# EAGLE schematic clock sync (EAGLE 6.5.0)

## Sheet 1 of 2
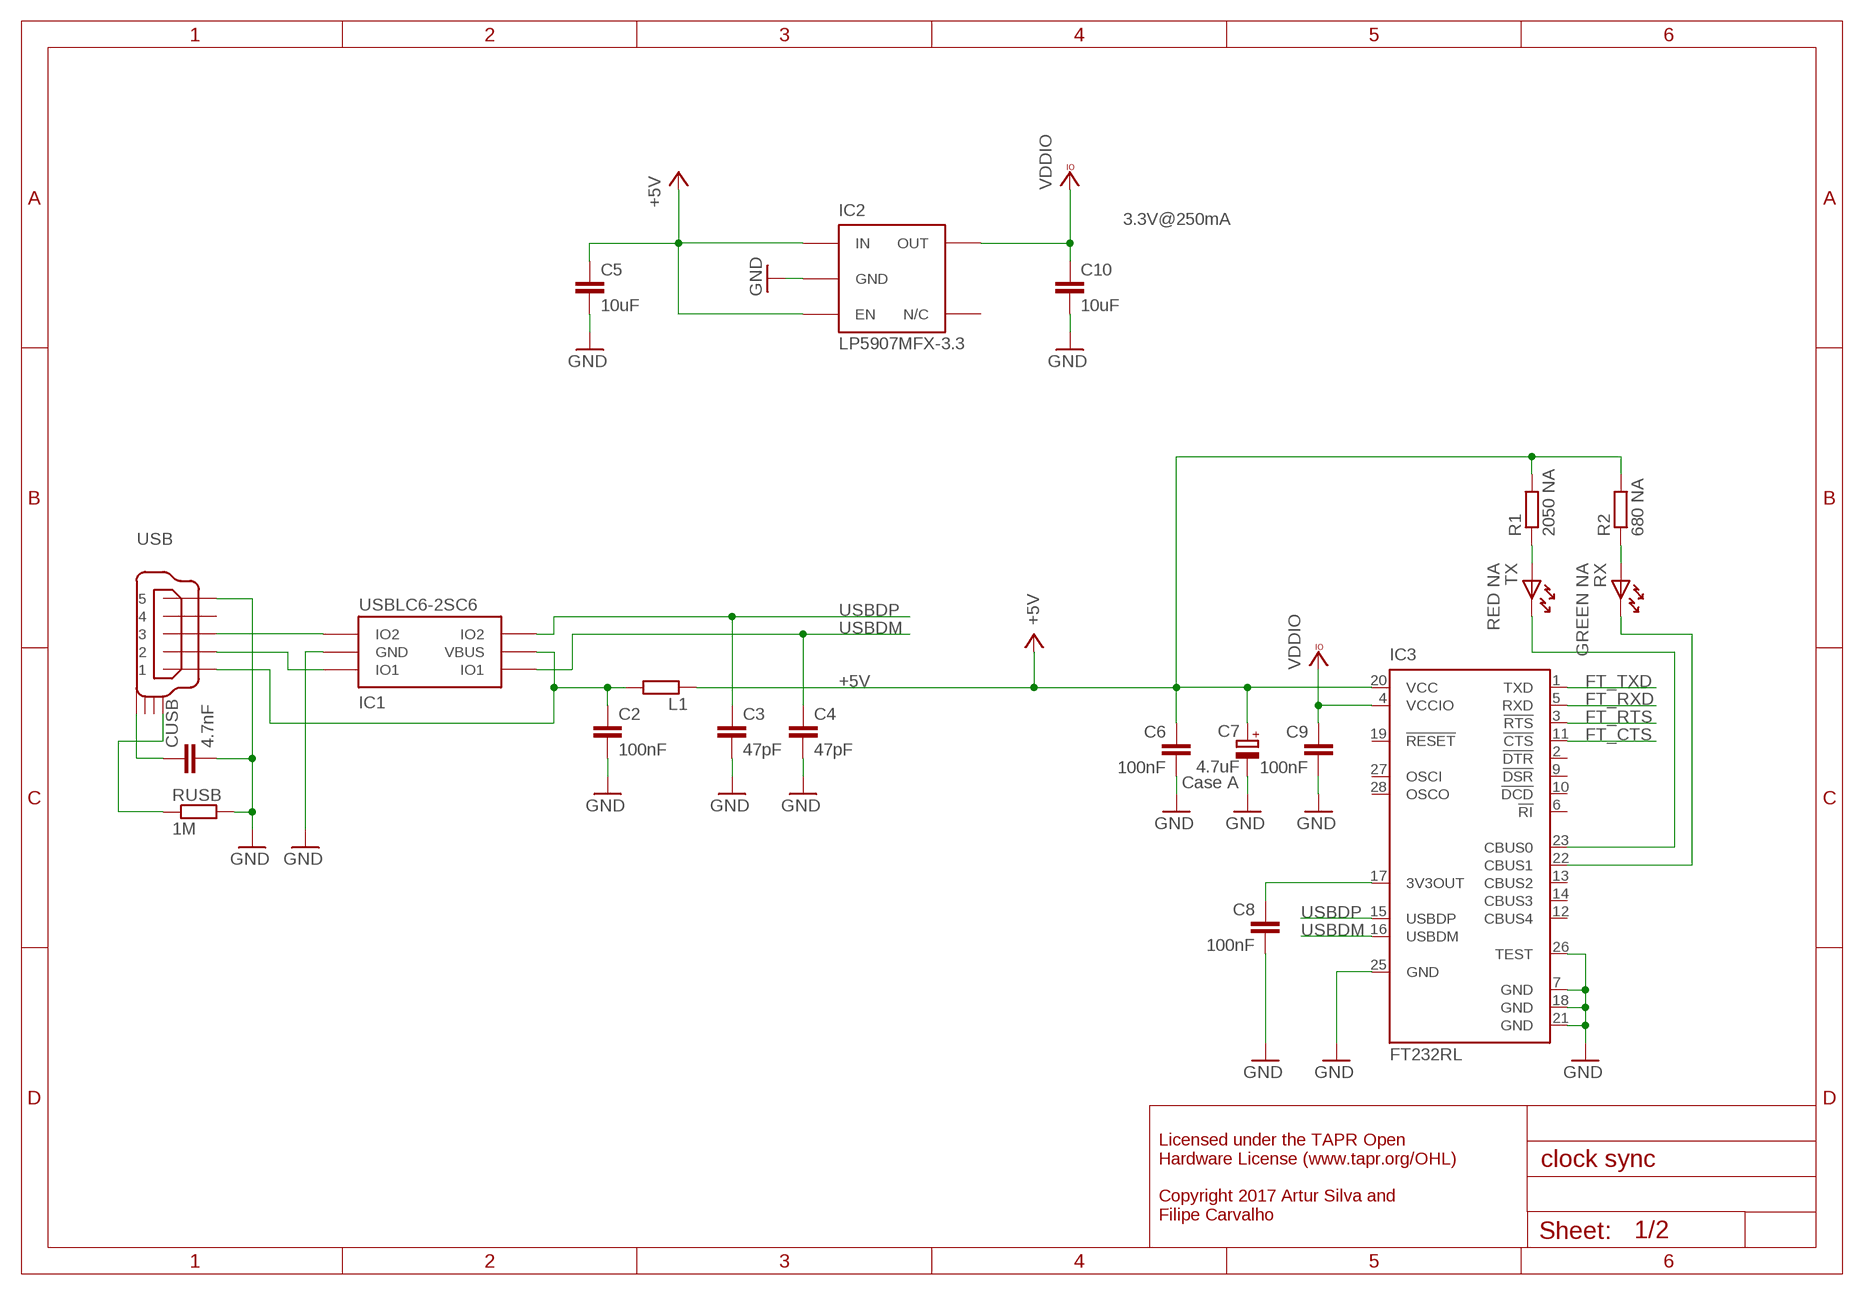
[diagram p0: schematic, sheet 1]

### Parts
C2  100nF  C-EUC0402  [C0402]
C3  47pF  C-EUC0402  [C0402]
C4  47pF  C-EUC0402  [C0402]
C5  10uF  C-EUC0603  [C0603]
C6  100nF  C-EUC0402  [C0402]
C7  4.7uF  CPOL-EUA/3216-18W  [A/3216-18W]
C8  100nF  C-EUC0402  [C0402]
C9  100nF  C-EUC0402  [C0402]
C10  10uF  C-EUC0603  [C0603]
CUSB  4.7nF  C-EUC0402  [C0402]
IC1  USBLC6-2SC6  USBLC6-2  [SOT23-6L]
IC2  LP5907MFX-3.3  TLV700XX  [TSOT23-5]
IC3  FT232RL  [SSOP28]
L1  ???  R-EU_R0805  [R0805]
R1  2050 NA  R-EU_R0402  [R0402]
R2  680 NA  R-EU_R0402  [R0402]
RUSB  1M  R-EU_R0402  [R0402]
RX  GREEN NA  LEDHAND  [LED_HAND]
TX  RED NA  LEDHAND  [LED_HAND]
USB  USB_MINI_B  [240-0002-1]

### Nets
+5V: C5.1 C6.1 C7.+ IC2.1(IN) IC2.3(EN) IC3.20(VCC) L1.1 R1.2 R2.2
FT_CTS: IC3.11(!CTS) ; also sheet 2
FT_RTS: IC3.3(!RTS) ; also sheet 2
FT_RXD: IC3.5(RXD) ; also sheet 2
FT_TXD: IC3.1(TXD) ; also sheet 2
GND: C2.2 C3.2 C4.2 C5.2 C6.2 C7.- C8.2 C9.2 C10.2 CUSB.2 IC1.P$2(GND) IC2.2(GND) IC3.7(GND) IC3.18(GND) IC3.21(GND) IC3.25(GND) IC3.26(TEST) RUSB.2 USB.P$5 ; also sheet 2
N$38: C8.1 IC3.17(3V3OUT)
N$39: C2.1 IC1.P$5(VBUS) L1.2 USB.P$1
N$40: IC1.P$1(IO1) USB.P$2
N$47: R2.1 RX.A
N$48: IC3.23(CBUS0) TX.K
N$49: IC3.22(CBUS1) RX.K
N$50: IC1.P$3(IO2) USB.P$3
N$59: CUSB.1 USB.SHIELD_4
N$61: RUSB.1 USB.SHIELD_1
N$62: R1.1 TX.A
USBDM: C4.1 IC1.P$6(IO1) IC3.16(USBDM)
USBDP: C3.1 IC1.P$4(IO2) IC3.15(USBDP)
VCCIO: C9.1 C10.1 IC2.5(OUT) IC3.4(VCCIO) ; supply symbol labelled VDDIO ; also sheet 2
Unconnected: IC2.4(N/C) IC3.2(!DTR) IC3.6(!RI) IC3.9(!DSR) IC3.10(!DCD) IC3.12(CBUS4) IC3.13(CBUS2) IC3.14(CBUS3) IC3.19(!RESET) IC3.27(OSCI) IC3.28(OSCO) USB.P$4 USB.SHIELD_2 USB.SHIELD_3

### Notes on the sheet
- 3.3V@250mA
- Case A
- Licensed under the TAPR Open
  Hardware License (www.tapr.org/OHL)
  
  Copyright 2017 Artur Silva and 
  Filipe Carvalho

## Sheet 2 of 2
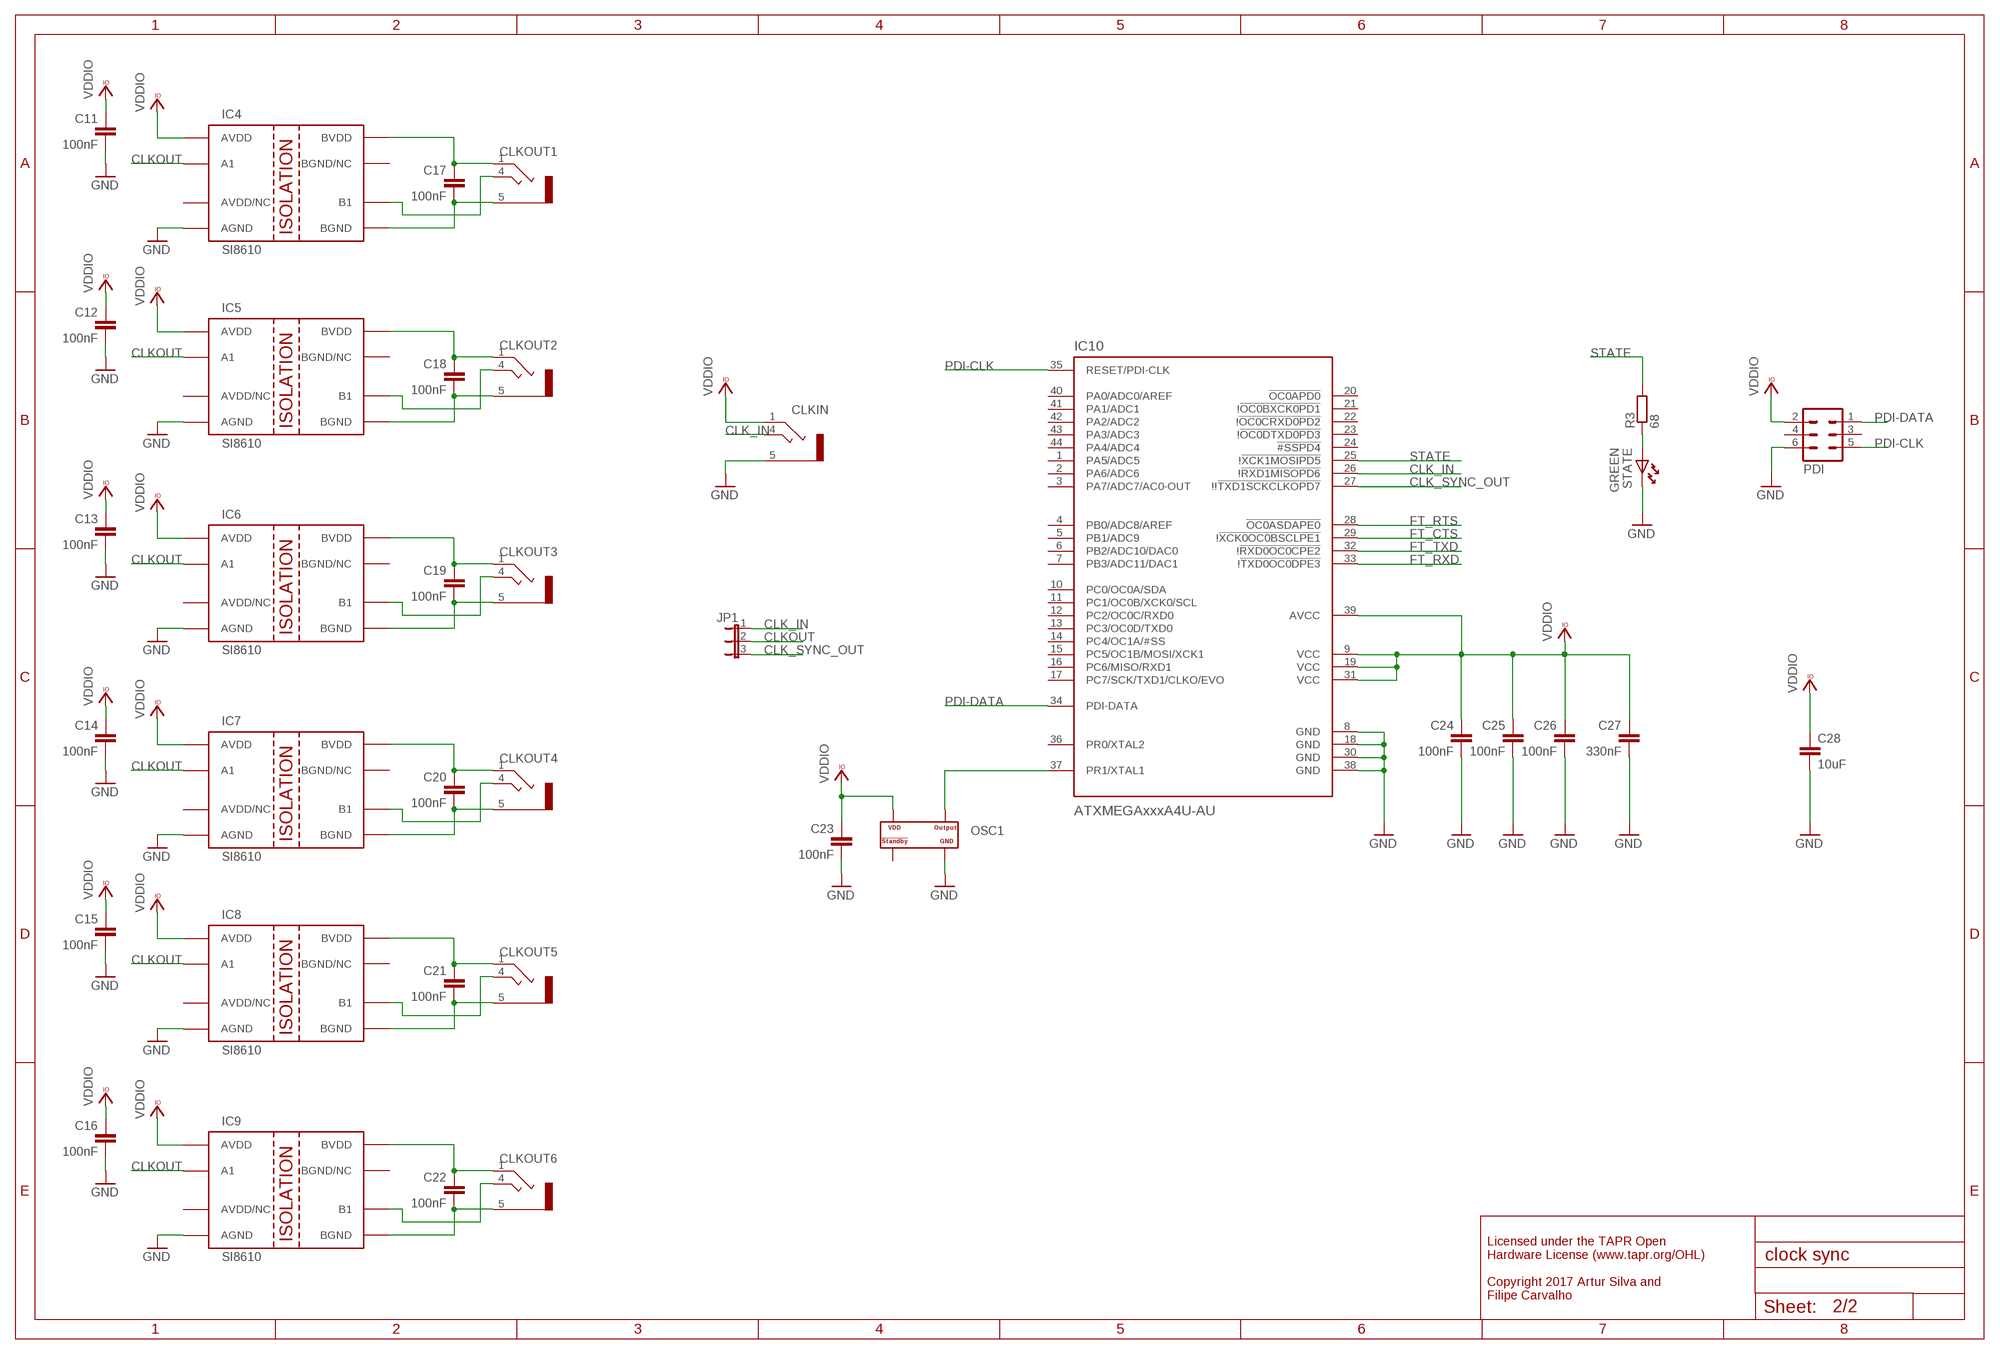
[diagram p1: schematic, sheet 2]

### Parts
C11  100nF  C-EUC0402  [C0402]
C12  100nF  C-EUC0402  [C0402]
C13  100nF  C-EUC0402  [C0402]
C14  100nF  C-EUC0402  [C0402]
C15  100nF  C-EUC0402  [C0402]
C16  100nF  C-EUC0402  [C0402]
C17  100nF  C-EUC0402  [C0402]
C18  100nF  C-EUC0402  [C0402]
C19  100nF  C-EUC0402  [C0402]
C20  100nF  C-EUC0402  [C0402]
C21  100nF  C-EUC0402  [C0402]
C22  100nF  C-EUC0402  [C0402]
C23  100nF  C-EUC0402  [C0402]
C24  100nF  C-EUC0402  [C0402]
C25  100nF  C-EUC0402  [C0402]
C26  100nF  C-EUC0402  [C0402]
C27  330nF  C-EUC0402  [C0402]
C28  10uF  C-EUC0603  [C0603]
CLKIN  STEREO_JACK  [35RASMT2BHNTRX]
CLKOUT1  STEREO_JACK  [35RASMT2BHNTRX]
CLKOUT2  STEREO_JACK  [35RASMT2BHNTRX]
CLKOUT3  STEREO_JACK  [35RASMT2BHNTRX]
CLKOUT4  STEREO_JACK  [35RASMT2BHNTRX]
CLKOUT5  STEREO_JACK  [35RASMT2BHNTRX]
CLKOUT6  STEREO_JACK  [35RASMT2BHNTRX]
IC4  SI8610  [SO-08]
IC5  SI8610  [SO-08]
IC6  SI8610  [SO-08]
IC7  SI8610  [SO-08]
IC8  SI8610  [SO-08]
IC9  SI8610  [SO-08]
IC10  ATXMEGAxxxA4U-AU  AT-XMEGA-XXA4-AU  [QFP80P1200X1200X120-44N]
JP1  JP2E"  [JP2_NO_NUMBERS]
OSC1  OSCILLATOR  [OSCILLATOR_3.2X2.5]
PDI  MA03-2  [MA03-2]
R3  68  R-EU_R0402  [R0402]
STATE  GREEN  LEDHAND  [LED_HAND]

### Nets
CLK_IN: CLKIN.4 IC10.26(!!RXD1MISOPD6) JP1.1
CLK_SYNC_OUT: IC10.27(!!!TXD1SCKCLKOPD7) JP1.3
CLKOUT: IC4.2(A1) IC5.2(A1) IC6.2(A1) IC7.2(A1) IC8.2(A1) IC9.2(A1) JP1.2
FT_CTS: IC10.29(!!XCK0OC0BSCLPE1) ; also sheet 1
FT_RTS: IC10.28(!OC0ASDAPE0) ; also sheet 1
FT_RXD: IC10.33(!!TXD0OC0DPE3) ; also sheet 1
FT_TXD: IC10.32(!!RXD0OC0CPE2) ; also sheet 1
GND: C11.2 C12.2 C13.2 C14.2 C15.2 C16.2 C23.2 C24.2 C25.2 C26.2 C27.2 C28.2 CLKIN.5 IC4.4(AGND) IC5.4(AGND) IC6.4(AGND) IC7.4(AGND) IC8.4(AGND) IC9.4(AGND) IC10.8(GND) IC10.18(GND) IC10.30(GND) IC10.38(GND) OSC1.P$2(GND) PDI.6 STATE.K ; also sheet 1
N$1: CLKOUT1.4 IC4.6(B1)
N$2: C18.1 CLKOUT2.1 IC5.8(BVDD)
N$3: C18.2 CLKOUT2.5 IC5.5(BGND)
N$4: CLKOUT2.4 IC5.6(B1)
N$5: C19.1 CLKOUT3.1 IC6.8(BVDD)
N$6: C19.2 CLKOUT3.5 IC6.5(BGND)
N$7: CLKOUT3.4 IC6.6(B1)
N$8: C20.1 CLKOUT4.1 IC7.8(BVDD)
N$9: C20.2 CLKOUT4.5 IC7.5(BGND)
N$10: CLKOUT4.4 IC7.6(B1)
N$11: C21.1 CLKOUT5.1 IC8.8(BVDD)
N$12: C21.2 CLKOUT5.5 IC8.5(BGND)
N$13: C17.1 CLKOUT1.1 IC4.8(BVDD)
N$14: CLKOUT5.4 IC8.6(B1)
N$15: C22.1 CLKOUT6.1 IC9.8(BVDD)
N$16: C22.2 CLKOUT6.5 IC9.5(BGND)
N$18: C17.2 CLKOUT1.5 IC4.5(BGND)
N$19: CLKOUT6.4 IC9.6(B1)
N$23: R3.1 STATE.A
OSC1: IC10.37(PR1/XTAL1) OSC1.P$3(OUTPUT)
PDI-CLK: IC10.35(RESET/PDI-CLK) PDI.5
PDI-DATA: IC10.34(PDI-DATA) PDI.1
STATE: IC10.25(!!XCK1MOSIPD5) R3.2
VCCIO: C11.1 C12.1 C13.1 C14.1 C15.1 C16.1 C23.1 C24.1 C25.1 C26.1 C27.1 C28.1 CLKIN.1 IC4.1(AVDD) IC5.1(AVDD) IC6.1(AVDD) IC7.1(AVDD) IC8.1(AVDD) IC9.1(AVDD) IC10.9(VCC) IC10.19(VCC) IC10.31(VCC) IC10.39(AVCC) OSC1.P$4(VDD) PDI.2 ; supply symbol labelled VDDIO ; also sheet 1
Unconnected: IC4.3(AVDD/NC) IC4.7(BGND/NC) IC5.3(AVDD/NC) IC5.7(BGND/NC) IC6.3(AVDD/NC) IC6.7(BGND/NC) IC7.3(AVDD/NC) IC7.7(BGND/NC) IC8.3(AVDD/NC) IC8.7(BGND/NC) IC9.3(AVDD/NC) IC9.7(BGND/NC) IC10.1(PA5/ADC5) IC10.2(PA6/ADC6) IC10.3(PA7/ADC7/AC0-OUT) IC10.4(PB0/ADC8/AREF) IC10.5(PB1/ADC9) IC10.6(PB2/ADC10/DAC0) IC10.7(PB3/ADC11/DAC1) IC10.10(PC0/OC0A/SDA) IC10.11(PC1/OC0B/XCK0/SCL) IC10.12(PC2/OC0C/RXD0) IC10.13(PC3/OC0D/TXD0) IC10.14(PC4/OC1A/#SS) IC10.15(PC5/OC1B/MOSI/XCK1) IC10.16(PC6/MISO/RXD1) IC10.17(PC7/SCK/TXD1/CLKO/EVO) IC10.20(!OC0APD0) IC10.21(!!OC0BXCK0PD1) IC10.22(!!OC0CRXD0PD2) IC10.23(!!OC0DTXD0PD3) IC10.24(!#SSPD4) IC10.36(PR0/XTAL2) IC10.40(PA0/ADC0/AREF) IC10.41(PA1/ADC1) IC10.42(PA2/ADC2) IC10.43(PA3/ADC3) IC10.44(PA4/ADC4) OSC1.P$1(STANDBY#) PDI.3 PDI.4

### Notes on the sheet
- Licensed under the TAPR Open
  Hardware License (www.tapr.org/OHL)
  
  Copyright 2017 Artur Silva and 
  Filipe Carvalho

## Library data of the parts
C2-C6 C8-C28 CUSB = rcl:C-EU: CAPACITOR, European symbol
C7 = rcl:CPOL-EU: POLARIZED CAPACITOR, European symbol
CLKIN CLKOUT1-CLKOUT6 = CNP-connectors:STEREO_JACK
IC1 = CNP 2:USBLC6-2
IC2 = CNP:TLV700XX
IC3 = ftdichip:FT232R: Source: http://www.ftdichip.com/Documents/DataSheets/DS_FT232R_v104.pdf; MPN: FT232RL; OC_FARNELL: 1146032; OC_NEWARK: 91K9918
IC4-IC9 = CNP-ics 2:SI8610
IC10 = xmega-a4:AT-XMEGA-XXA4-AU: ATxMega a4 Serie
JP1 = jumper:JP2E: JUMPER
L1 R1-R3 RUSB = rcl:R-EU_: RESISTOR, European symbol
OSC1 = CNP-miscellaneous:OSCILLATOR
PDI = con-lstb:MA03-2: PIN HEADER; OC_FARNELL: unknown; OC_NEWARK: unknown
RX STATE TX = CNP-miscellaneous:LED
USB = CNP-connectors:USB_MINI_B